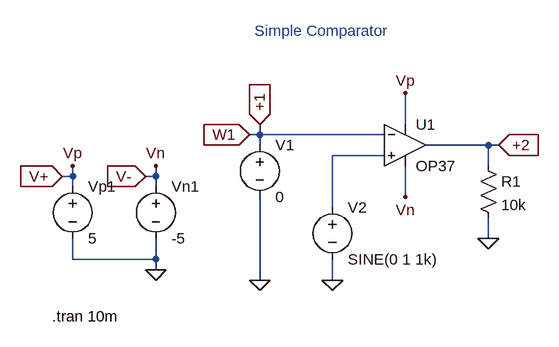
[diagram p0: schematic simple_comp.asc]
simple_comp.asc, the LTspice schematic file:
Version 4
SHEET 1 880 680
WIRE 432 112 432 64
WIRE 208 128 208 112
WIRE 208 128 192 128
WIRE 400 128 208 128
WIRE 208 144 208 128
WIRE 560 144 464 144
WIRE 576 144 560 144
WIRE 400 160 320 160
WIRE 560 176 560 144
WIRE -80 192 -80 176
WIRE -80 192 -96 192
WIRE 48 192 48 176
WIRE 48 192 32 192
WIRE -80 208 -80 192
WIRE 48 208 48 192
WIRE 432 224 432 176
WIRE 320 240 320 160
WIRE 560 288 560 256
WIRE -80 320 -80 288
WIRE 48 320 48 288
WIRE 48 320 -80 320
WIRE 48 336 48 320
WIRE 208 352 208 224
WIRE 320 352 320 320
FLAG 320 352 0
FLAG 48 336 0
FLAG -80 176 Vp
FLAG 48 176 Vn
FLAG 432 224 Vn
FLAG 432 64 Vp
FLAG 208 352 0
FLAG 560 288 0
FLAG 192 128 W1
IOPIN 192 128 In
FLAG 208 112 +1
IOPIN 208 112 In
FLAG 576 144 +2
IOPIN 576 144 In
FLAG -96 192 V+
IOPIN -96 192 In
FLAG 32 192 V-
IOPIN 32 192 In
SYMBOL voltage 208 128 R0
WINDOW 123 0 0 Left 0
WINDOW 39 0 0 Left 0
SYMATTR InstName V1
SYMATTR Value 0
SYMBOL voltage 48 192 R0
WINDOW 123 0 0 Left 0
WINDOW 39 0 0 Left 0
SYMATTR InstName Vn1
SYMATTR Value -5
SYMBOL voltage -80 192 R0
WINDOW 123 0 0 Left 0
WINDOW 39 0 0 Left 0
SYMATTR InstName Vp1
SYMATTR Value 5
SYMBOL voltage 320 224 R0
WINDOW 123 0 0 Left 0
WINDOW 39 0 0 Left 0
SYMATTR InstName V2
SYMATTR Value SINE(0 1 1k)
SYMBOL res 544 160 R0
SYMATTR InstName R1
SYMATTR Value 10k
SYMBOL Opamps\\OP37 432 80 R0
SYMATTR InstName U1
TEXT -112 408 Left 2 !.tran 10m
TEXT 200 -32 Left 2 ;Simple Comparator

The netlist it stands for:
* simple_comp.asc
V1 +1 0 0
Vn1 V- 0 -5
Vp1 V+ 0 5
V2 N001 0 SINE(0 1 1k)
R1 +2 0 10k
XU1 N001 +1 V+ V- +2 LT1037  ; OP37, pins In+ In- V+ V- OUT
.tran 10m
* Simple Comparator
.lib LTC.lib
.backanno
.end